# Altium project L_ASMR.PrjPcb
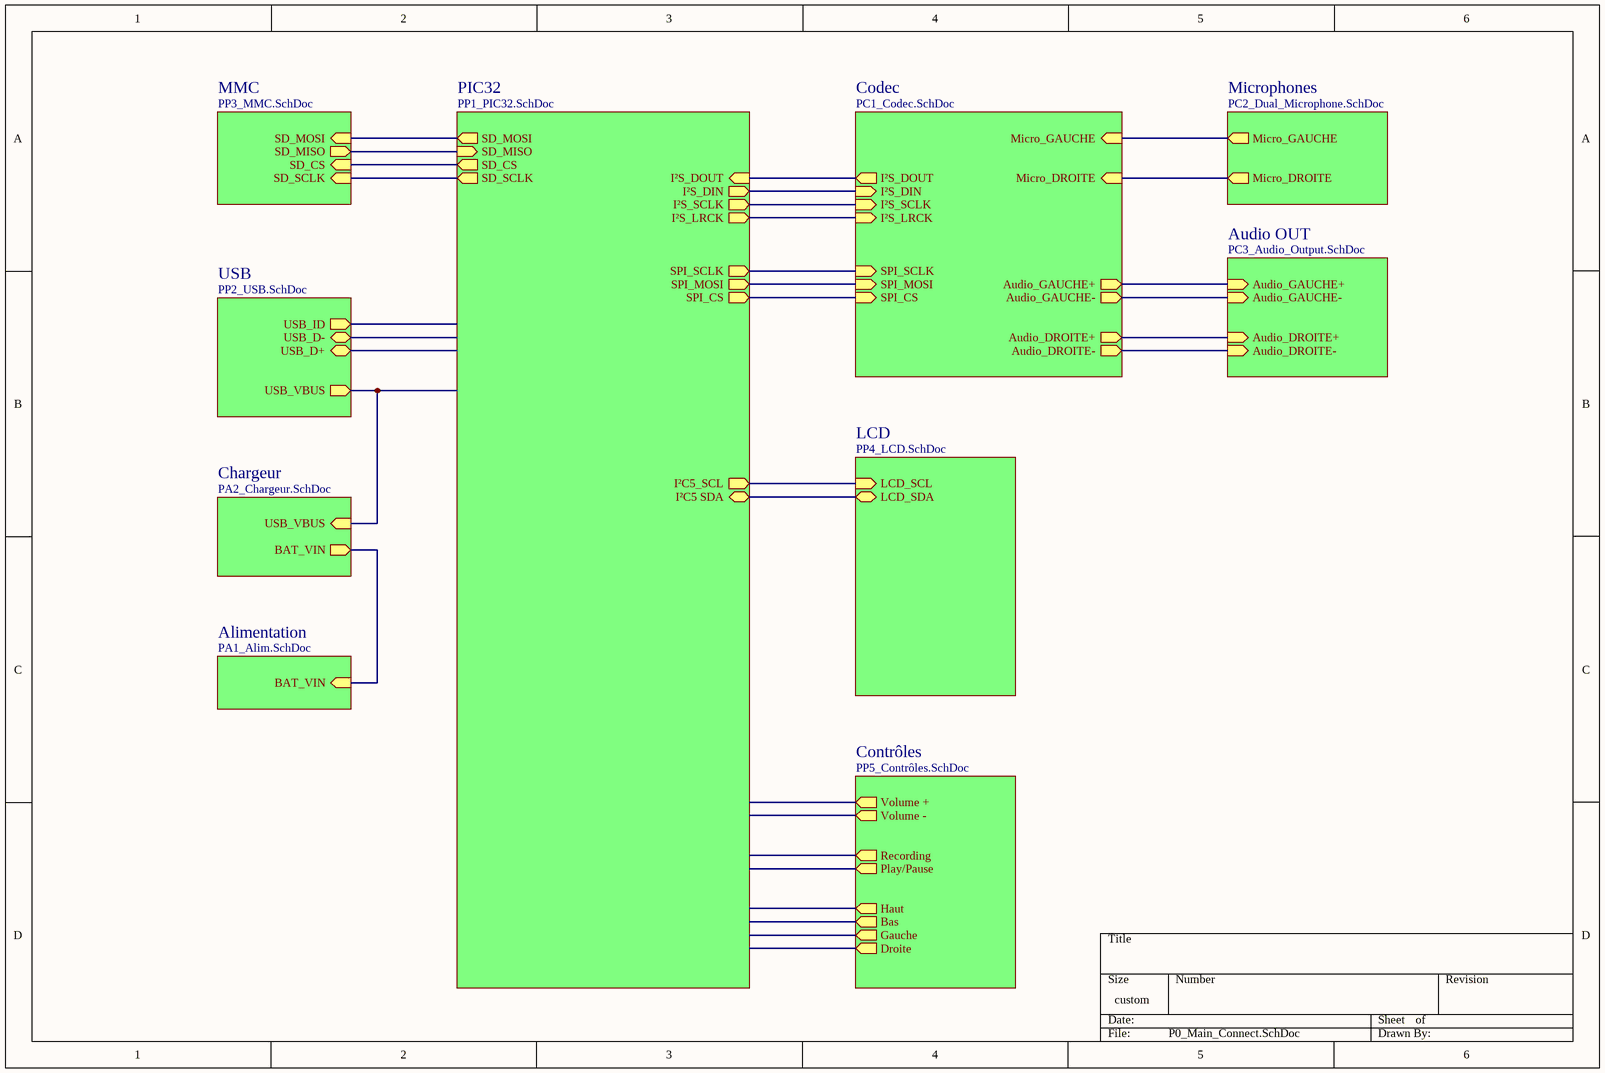
[diagram p0: P0_Main_Connect.SchDoc]
11 sheets, 116 parts. Net scope: hierarchical (ports join the sheet entries above them; power ports are global).
Sheets:
  P0_Main_Connect.SchDoc
    Alimentation = PA1_Alim.SchDoc
    Microphones = PC2_Dual_Microphone.SchDoc
    Audio OUT = PC3_Audio_Output.SchDoc
    Codec = PC1_Codec.SchDoc
    PIC32 = PP1_PIC32.SchDoc
    USB = PP2_USB.SchDoc
    MMC = PP3_MMC.SchDoc
    Chargeur = PA2_Chargeur.SchDoc
    LCD = PP4_LCD.SchDoc
    Contrôles = PP5_Contrôles.SchDoc

## Sheet P0_Main_Connect.SchDoc
size 299 x 199 mm

### Sub-sheets
Alimentation = PA1_Alim.SchDoc: BAT_VIN (in)
Audio OUT = PC3_Audio_Output.SchDoc: Audio_GAUCHE+ (in), Audio_GAUCHE- (in), Audio_DROITE+ (in), Audio_DROITE- (in)
Chargeur = PA2_Chargeur.SchDoc: USB_VBUS (in), BAT_VIN (out)
Codec = PC1_Codec.SchDoc: Micro_GAUCHE (in), Micro_DROITE (in), Audio_GAUCHE+ (out), Audio_GAUCHE- (out), Audio_DROITE+ (out), Audio_DROITE- (out), I²S_DIN (in), I²S_DOUT (out), SPI_MOSI (in), I²S_LRCK (in), I²S_SCLK (in), SPI_SCLK (in), SPI_CS (in)
Contrôles = PP5_Contrôles.SchDoc: Haut (out), Play/Pause (out), Bas (out), Recording (out), Volume + (out), Volume - (out), Gauche (out), Droite (out)
LCD = PP4_LCD.SchDoc: LCD_SCL (in), LCD_SDA (bidir)
Microphones = PC2_Dual_Microphone.SchDoc: Micro_GAUCHE (out), Micro_DROITE (out)
MMC = PP3_MMC.SchDoc: SD_MOSI (in), SD_MISO (out), SD_CS (in), SD_SCLK (in)
PIC32 = PP1_PIC32.SchDoc: I²C5_SCL (out), I²C5 SDA (bidir), I²S_LRCK (out), I²S_DIN (out), I²S_SCLK (out), I²S_DOUT (in), SPI_MOSI (out), SPI_CS (out), SPI_SCLK (out), SD_SCLK (out), SD_CS (out), SD_MOSI (out), SD_MISO (in)
USB = PP2_USB.SchDoc: USB_ID (out), USB_D- (bidir), USB_D+ (bidir), USB_VBUS (out)

### Nets
CS: sheet PIC32/SD_CS, sheet MMC/SD_CS
MISO: sheet PIC32/SD_MISO, sheet MMC/SD_MISO
MOSI: sheet PIC32/SD_MOSI, sheet MMC/SD_MOSI
SCLK: sheet PIC32/SD_SCLK, sheet MMC/SD_SCLK
NetC?#5_2: sheet Microphones/Micro_GAUCHE, sheet Codec/Micro_GAUCHE
NetC?#11_2: sheet Microphones/Micro_DROITE, sheet Codec/Micro_DROITE
NetC?#14_1: sheet Audio OUT/Audio_GAUCHE-, sheet Codec/Audio_GAUCHE-
NetC?#17_1: sheet Audio OUT/Audio_GAUCHE+, sheet Codec/Audio_GAUCHE+
NetC?#20_1: sheet Audio OUT/Audio_DROITE-, sheet Codec/Audio_DROITE-
NetC?#23_1: sheet Audio OUT/Audio_DROITE+, sheet Codec/Audio_DROITE+
NetC?#37_2: sheet USB/USB_VBUS, sheet Chargeur/USB_VBUS
NetC?#40_2: sheet Alimentation/BAT_VIN, sheet Chargeur/BAT_VIN
NetDS?_3: sheet PIC32/I²C5_SCL, sheet LCD/LCD_SCL
NetDS?_4: sheet PIC32/I²C5 SDA, sheet LCD/LCD_SDA
NetU?#8_43: sheet Codec/SPI_MOSI, sheet PIC32/SPI_MOSI
NetU?#8_44: sheet Codec/SPI_SCLK, sheet PIC32/SPI_SCLK
NetU?#8_45: sheet Codec/SPI_CS, sheet PIC32/SPI_CS
(unnamed): sheet Codec/I²S_DIN, sheet PIC32/I²S_DIN
(unnamed): sheet Codec/I²S_DOUT, sheet PIC32/I²S_DOUT
(unnamed): sheet Codec/I²S_LRCK, sheet PIC32/I²S_LRCK
(unnamed): sheet Codec/I²S_SCLK, sheet PIC32/I²S_SCLK

## Sheet PA1_Alim.SchDoc
size 199 x 149 mm
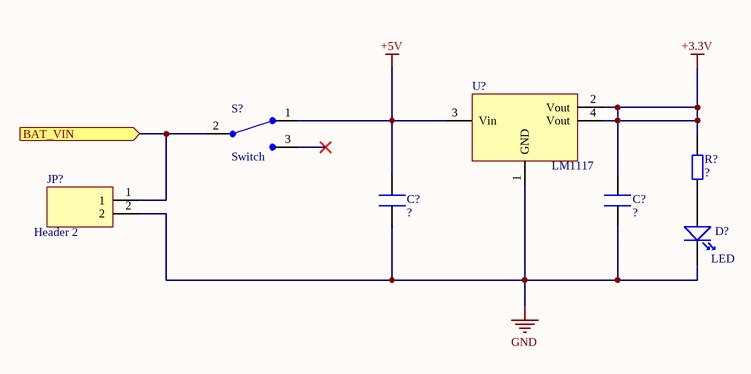
[diagram p1: PA1_Alim.SchDoc]

### Parts
(Parts that share a designator on the sheet are numbered #1, #2 ... from top to bottom, then left to right.)
C?#1  Condo  (value not drawn)  (no BOM)
C?#2  Condo  (value not drawn)  (no BOM)
D?#1  LED  (no BOM)
JP?#1  Header 2  (no BOM)
R?#1  Res  (value not drawn)  (no BOM)
S?#1  Switch  (no BOM)
U?#1  LM1117

### Ports
BAT_VIN (in)

### Nets
+3.3V: C?#2.2 R?#1.2 U?#1.2(Vout) U?#1.4(Vout)
+5V: C?#1.2 S?#1.1(Vout) U?#1.3(Vin)
GND: C?#1.1 C?#2.1 D?#1.2(-) JP?#1.2 U?#1.1(GND)
NetC?#40_2: JP?#1.1 S?#1.2(Vin) ; port BAT_VIN
NetD?#1_1: D?#1.1(+) R?#1.1

Not connected (* = marked no-connect by the designer): S?#1 3(NC)*

### Library data of the parts
C?#1 C?#2 = Condo: Condensateur; Valeur: ?
D?#1 = LED: LED Standard
JP?#1 = Header 2: Header 2 Pins Mâle
R?#1 = Res: Résistance; Valeur: ?
S?#1 = Switch: Switch Standard 3 Pins
U?#1 = LM1117: Régulateur de tension; Fabricant: Texas Instruments; DataSheet: http://www.farnell.com/datasheets/2019100.pdf; RefFabricant: LM1117

## Sheet PC2_Dual_Microphone.SchDoc
size 250 x 200 mm
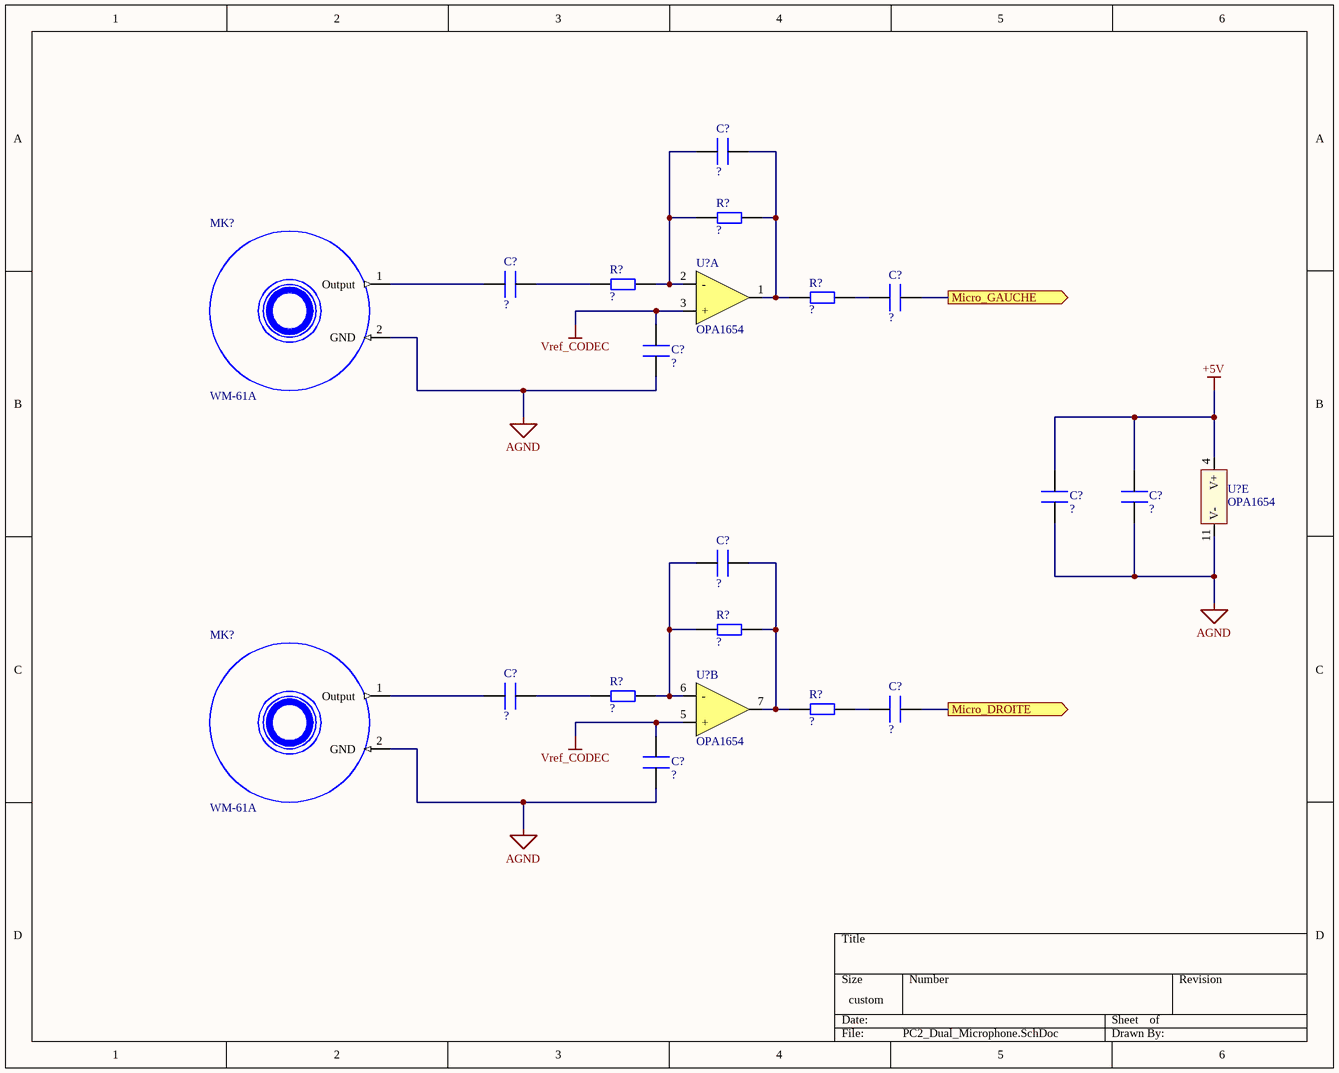
[diagram p2: PC2_Dual_Microphone.SchDoc]

### Parts
(Parts that share a designator on the sheet are numbered #1, #2 ... from top to bottom, then left to right.)
C?#3  Condo  (value not drawn)  (no BOM)
C?#4  Condo  (value not drawn)  (no BOM)
C?#5  Condo  (value not drawn)  (no BOM)
C?#6  Condo  (value not drawn)  (no BOM)
C?#7  Condo  (value not drawn)  (no BOM)
C?#8  Condo  (value not drawn)  (no BOM)
C?#9  Condo  (value not drawn)  (no BOM)
C?#10  Condo  (value not drawn)  (no BOM)
C?#11  Condo  (value not drawn)  (no BOM)
C?#12  Condo  (value not drawn)  (no BOM)
MK?#1  WM-61A
MK?#2  WM-61A
R?#2  Res  (value not drawn)  (no BOM)
R?#3  Res  (value not drawn)  (no BOM)
R?#4  Res  (value not drawn)  (no BOM)
R?#5  Res  (value not drawn)  (no BOM)
R?#6  Res  (value not drawn)  (no BOM)
R?#7  Res  (value not drawn)  (no BOM)
U?#2  OPA1654  (part A of 5)
U?#3  OPA1654  (part E of 5)
U?#4  OPA1654  (part B of 5)

### Ports
Micro_DROITE (out), Micro_GAUCHE (out)

### Nets
+5V: C?#7.2 C?#8.2 U?#3.4(V+)
AGND: C?#6.1 C?#7.1 C?#8.1 C?#12.1 MK?#1.2(GND) MK?#2.2(GND) U?#3.11(V-)
Vref_CODEC: C?#6.2 C?#12.2 U?#2.3(+) U?#4.5(+)
NetC?#3_1: C?#3.1 R?#2.2 R?#4.1 U?#2.1(OUT)
NetC?#3_2: C?#3.2 R?#2.1 R?#3.2 U?#2.2(-)
NetC?#4_1: C?#4.1 MK?#1.1(Output)
NetC?#4_2: C?#4.2 R?#3.1
NetC?#5_1: C?#5.1 R?#4.2
NetC?#5_2: C?#5.2 ; port Micro_GAUCHE
NetC?#9_1: C?#9.1 R?#5.2 R?#7.1 U?#4.7(OUT)
NetC?#9_2: C?#9.2 R?#5.1 R?#6.2 U?#4.6(-)
NetC?#10_1: C?#10.1 MK?#2.1(Output)
NetC?#10_2: C?#10.2 R?#6.1
NetC?#11_1: C?#11.1 R?#7.2
NetC?#11_2: C?#11.2 ; port Micro_DROITE

### Library data of the parts
C?#3-C?#12 = Condo: Condensateur; Valeur: ?
MK?#1 MK?#2 = WM-61A: Microphone (sur Header); Fabricant: INSIKES; RefFabricant: WM-61A; DataSheet: https://components101.com/sites/default/files/component_datasheet/Electret%20Condenser%20Microphone.pdf
R?#2-R?#7 = Res: Résistance; Valeur: ?
U?#2-U?#4 = OPA1654: Quad Audio AmpliOp; Fabricant: TEXAS INSTRUMENTS; RefFabricant: OPA1654; DataSheet: http://www.ti.com/lit/ds/symlink/opa1654.pdf

## Sheet PC3_Audio_Output.SchDoc
size 250 x 200 mm
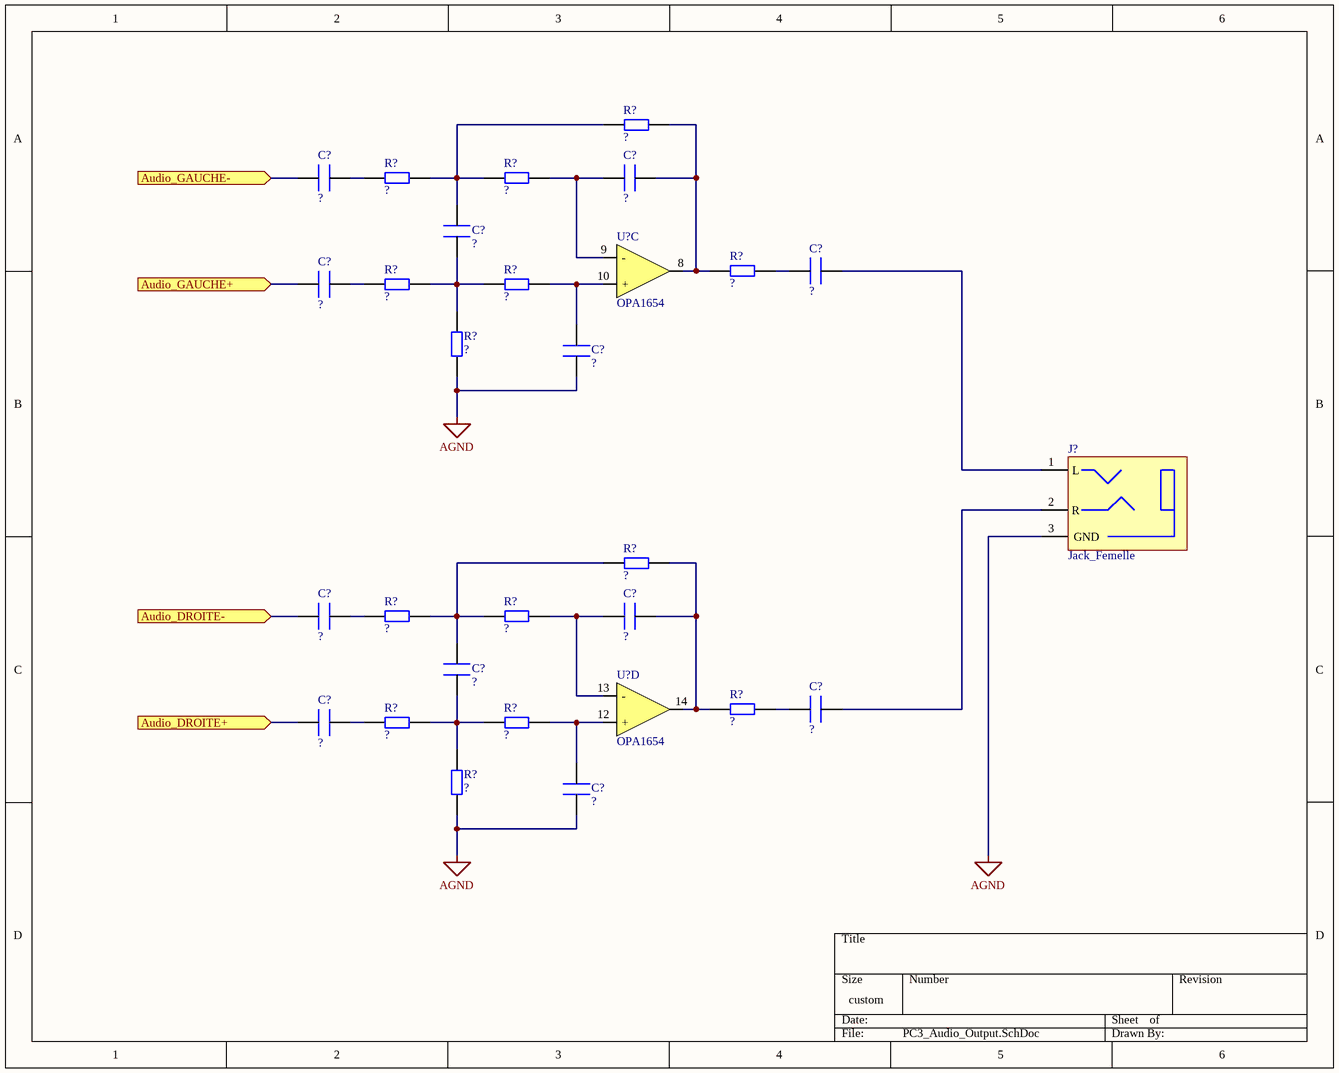
[diagram p3: PC3_Audio_Output.SchDoc]

### Parts
(Parts that share a designator on the sheet are numbered #1, #2 ... from top to bottom, then left to right.)
C?#13  Condo  (value not drawn)  (no BOM)
C?#14  Condo  (value not drawn)  (no BOM)
C?#15  Condo  (value not drawn)  (no BOM)
C?#16  Condo  (value not drawn)  (no BOM)
C?#17  Condo  (value not drawn)  (no BOM)
C?#18  Condo  (value not drawn)  (no BOM)
C?#19  Condo  (value not drawn)  (no BOM)
C?#20  Condo  (value not drawn)  (no BOM)
C?#21  Condo  (value not drawn)  (no BOM)
C?#22  Condo  (value not drawn)  (no BOM)
C?#23  Condo  (value not drawn)  (no BOM)
C?#24  Condo  (value not drawn)  (no BOM)
J?  Jack_Femelle
R?#8  Res  (value not drawn)  (no BOM)
R?#9  Res  (value not drawn)  (no BOM)
R?#10  Res  (value not drawn)  (no BOM)
R?#11  Res  (value not drawn)  (no BOM)
R?#12  Res  (value not drawn)  (no BOM)
R?#13  Res  (value not drawn)  (no BOM)
R?#14  Res  (value not drawn)  (no BOM)
R?#15  Res  (value not drawn)  (no BOM)
R?#16  Res  (value not drawn)  (no BOM)
R?#17  Res  (value not drawn)  (no BOM)
R?#18  Res  (value not drawn)  (no BOM)
R?#19  Res  (value not drawn)  (no BOM)
R?#20  Res  (value not drawn)  (no BOM)
R?#21  Res  (value not drawn)  (no BOM)
U?#5  OPA1654  (part C of 5)
U?#6  OPA1654  (part D of 5)

### Ports
Audio_DROITE+ (in), Audio_DROITE- (in), Audio_GAUCHE+ (in), Audio_GAUCHE- (in)

### Nets
AGND: C?#18.1 C?#24.1 J?.3(GND) R?#14.1 R?#21.1
NetC?#13_1: C?#13.1 R?#8.2 R?#11.2 U?#5.8(OUT)
NetC?#13_2: C?#13.2 R?#10.2 U?#5.9(-)
NetC?#14_1: C?#14.1 ; port Audio_GAUCHE-
NetC?#14_2: C?#14.2 R?#9.1
NetC?#15_1: C?#15.1 R?#12.2 R?#13.1 R?#14.2
NetC?#15_2: C?#15.2 R?#8.1 R?#9.2 R?#10.1
NetC?#16_1: C?#16.1 J?.1(L)
NetC?#16_2: C?#16.2 R?#11.1
NetC?#17_1: C?#17.1 ; port Audio_GAUCHE+
NetC?#17_2: C?#17.2 R?#12.1
NetC?#18_2: C?#18.2 R?#13.2 U?#5.10(+)
NetC?#19_1: C?#19.1 R?#15.2 R?#18.2 U?#6.14(OUT)
NetC?#19_2: C?#19.2 R?#17.2 U?#6.13(-)
NetC?#20_1: C?#20.1 ; port Audio_DROITE-
NetC?#20_2: C?#20.2 R?#16.1
NetC?#21_1: C?#21.1 R?#19.2 R?#20.1 R?#21.2
NetC?#21_2: C?#21.2 R?#15.1 R?#16.2 R?#17.1
NetC?#22_1: C?#22.1 J?.2(R)
NetC?#22_2: C?#22.2 R?#18.1
NetC?#23_1: C?#23.1 ; port Audio_DROITE+
NetC?#23_2: C?#23.2 R?#19.1
NetC?#24_2: C?#24.2 R?#20.2 U?#6.12(+)

### Library data of the parts
C?#13-C?#24 = Condo: Condensateur; Valeur: ?
J? = Jack_Femelle: Prise Mini Jack Stéréo Femelle
R?#8-R?#21 = Res: Résistance; Valeur: ?
U?#5 U?#6 = OPA1654: as U?#2 on sheet PC2_Dual_Microphone; RefFabricant: OPA1654; DataSheet: http://www.ti.com/lit/ds/symlink/opa1654.pdf

## Sheet PC1_Codec.SchDoc
size 199 x 149 mm
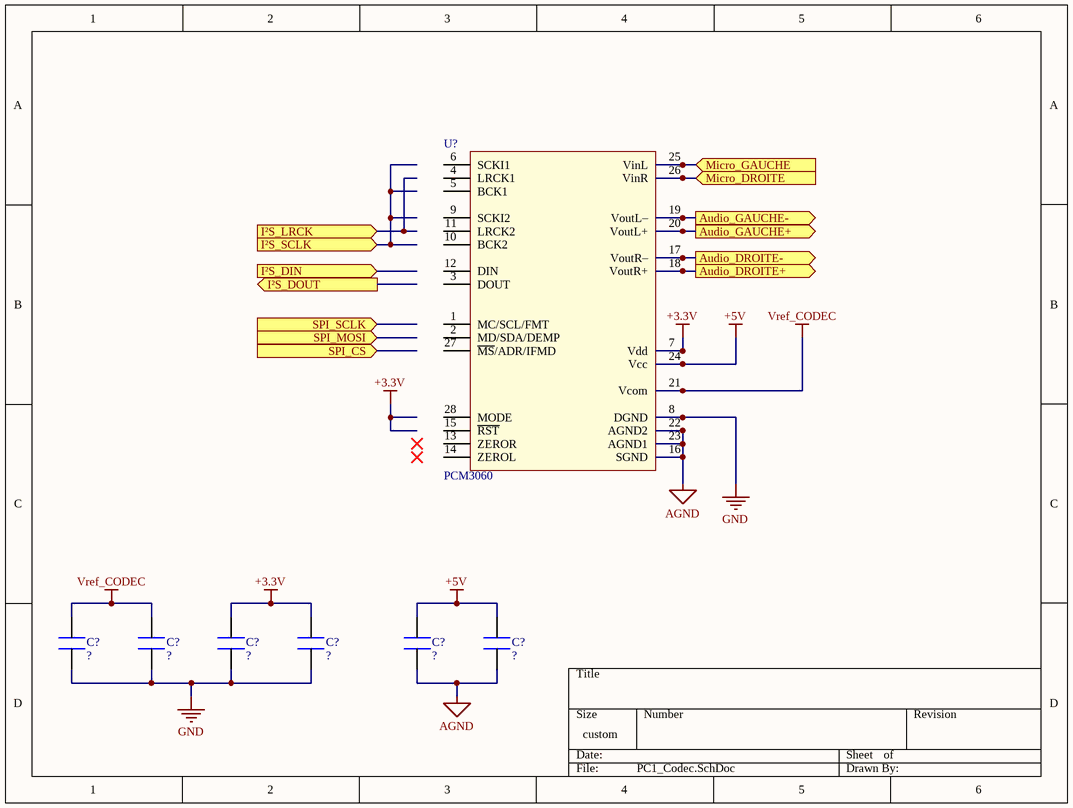
[diagram p4: PC1_Codec.SchDoc]

### Parts
(Parts that share a designator on the sheet are numbered #1, #2 ... from top to bottom, then left to right.)
C?#25  Condo  (value not drawn)  (no BOM)
C?#26  Condo  (value not drawn)  (no BOM)
C?#27  Condo  (value not drawn)  (no BOM)
C?#28  Condo  (value not drawn)  (no BOM)
C?#29  Condo  (value not drawn)  (no BOM)
C?#30  Condo  (value not drawn)  (no BOM)
U?#7  PCM3060

### Ports
Audio_DROITE+ (out), Audio_DROITE- (out), Audio_GAUCHE+ (out), Audio_GAUCHE- (out), I²S_DIN (in), I²S_DOUT (out), I²S_LRCK (in), I²S_SCLK (in), Micro_DROITE (in), Micro_GAUCHE (in), SPI_CS (in), SPI_MOSI (in), SPI_SCLK (in)

### Nets
+3.3V: C?#27.2 C?#28.2 U?#7.7(Vdd)
+5V: C?#29.2 C?#30.2 U?#7.24(Vcc)
AGND: C?#29.1 C?#30.1 U?#7.16(SGND) U?#7.22(AGND2) U?#7.23(AGND1)
GND: C?#25.1 C?#26.1 C?#27.1 C?#28.1 U?#7.8(DGND)
Vref_CODEC: C?#25.2 C?#26.2 U?#7.21(Vcom)
NetC?#5_2: U?#7.25(VinL) ; port Micro_GAUCHE
NetC?#11_2: U?#7.26(VinR) ; port Micro_DROITE
NetC?#14_1: U?#7.19(VoutL–) ; port Audio_GAUCHE-
NetC?#17_1: U?#7.20(VoutL+) ; port Audio_GAUCHE+
NetC?#20_1: U?#7.17(VoutR–) ; port Audio_DROITE-
NetC?#23_1: U?#7.18(VoutR+) ; port Audio_DROITE+

Not connected (* = marked no-connect by the designer): U?#7 1(MC/SCL/FMT) 2(MD/SDA/DEMP) 3(DOUT) 4(LRCK1) 5(BCK1) 6(SCKI1) 9(SCKI2) 10(BCK2) 11(LRCK2) 12(DIN) 13(ZEROR) 14(ZEROL) 15(~{RST}) 27(~{MS}/ADR/IFMD) 28(MODE)

### Library data of the parts
C?#25-C?#30 = Condo: Condensateur; Valeur: ?
U?#7 = PCM3060: Stéréo In/Out Audio Codec; Fabricant: TEXAS INSTRUMENTS; RefFabricant: PCM3060PW; Datasheet: http://www.ti.com/lit/ds/symlink/pcm3060.pdf

## Sheet PP1_PIC32.SchDoc
size 250 x 199 mm
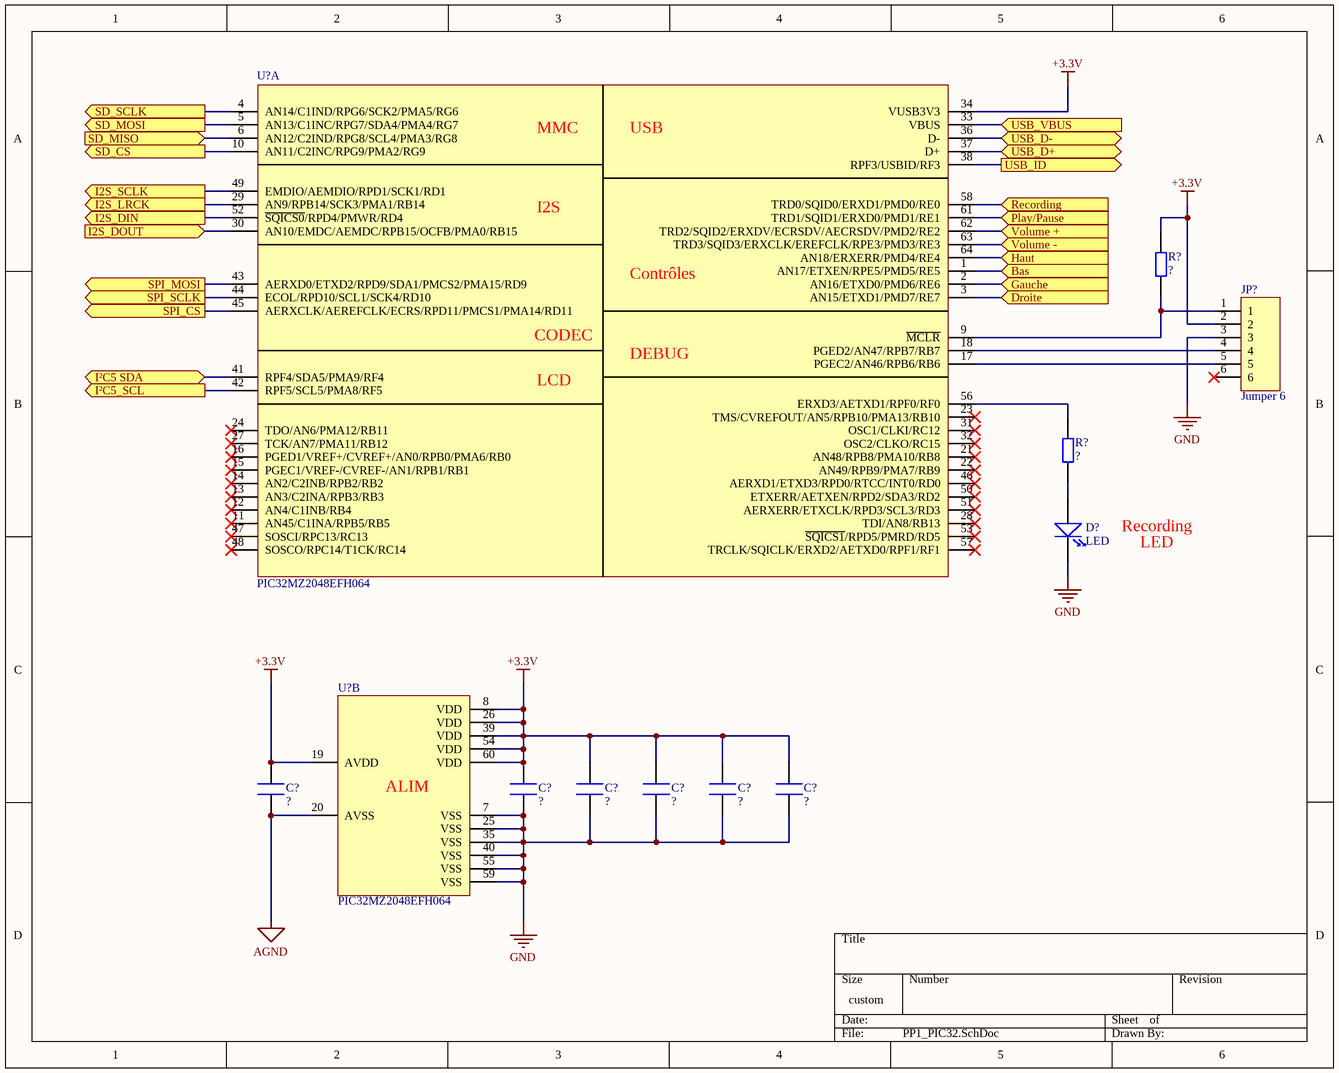
[diagram p5: PP1_PIC32.SchDoc]

### Parts
(Parts that share a designator on the sheet are numbered #1, #2 ... from top to bottom, then left to right.)
C?#31  Condo  (value not drawn)  (no BOM)
C?#32  Condo  (value not drawn)  (no BOM)
C?#33  Condo  (value not drawn)  (no BOM)
C?#34  Condo  (value not drawn)  (no BOM)
C?#35  Condo  (value not drawn)  (no BOM)
C?#36  Condo  (value not drawn)  (no BOM)
D?#2  LED  (no BOM)
JP?#2  Jumper 6  (no BOM)
R?#22  Res  (value not drawn)  (no BOM)
R?#23  Res  (value not drawn)  (no BOM)
U?#8  PIC32MZ2048EFH064  (part A of 2)
U?#9  PIC32MZ2048EFH064  (part B of 2)

### Ports
Bas (in), Droite (in), Gauche (in), Haut (in), I2S_DIN (out), I2S_DOUT (in), I2S_LRCK (out), I2S_SCLK (out), I²C5 SDA (bidir), I²C5_SCL (out), Play/Pause (in), Recording (in), SD_CS (out), SD_MISO (in), SD_MOSI (out), SD_SCLK (out), SPI_CS (out), SPI_MOSI (out), SPI_SCLK (out), USB_D+ (bidir), USB_D- (bidir), USB_ID (out), USB_VBUS (in), Volume + (in), Volume - (in)

### Nets
+3.3V: C?#31.2 C?#32.2 C?#33.2 C?#34.2 C?#35.2 C?#36.2 JP?#2.2 R?#22.1 U?#8.34(VUSB3V3) U?#9.8(VDD) U?#9.19(AVDD) U?#9.26(VDD) U?#9.39(VDD) U?#9.54(VDD) U?#9.60(VDD)
AGND: C?#31.1 U?#9.20(AVSS)
GND: C?#32.1 C?#33.1 C?#34.1 C?#35.1 C?#36.1 D?#2.2(-) JP?#2.3 U?#9.7(VSS) U?#9.25(VSS) U?#9.35(VSS) U?#9.40(VSS) U?#9.55(VSS) U?#9.59(VSS)
CS: U?#8.10(AN11/C2INC/RPG9/PMA2/RG9) ; port SD_CS
MISO: U?#8.6(AN12/C2IND/RPG8/SCL4/PMA3/RG8) ; port SD_MISO
MOSI: U?#8.5(AN13/C1INC/RPG7/SDA4/PMA4/RG7) ; port SD_MOSI
SCLK: U?#8.4(AN14/C1IND/RPG6/SCK2/PMA5/RG6) ; port SD_SCLK
NetD?#2_1: D?#2.1(+) R?#23.1
NetDS?_3: U?#8.42(RPF5/SCL5/PMA8/RF5) ; port I²C5_SCL
NetDS?_4: U?#8.41(RPF4/SDA5/PMA9/RF4) ; port I²C5 SDA
NetJP?#2_1: JP?#2.1 R?#22.2 U?#8.9(~{MCLR})
NetJP?#2_4: JP?#2.4 U?#8.18(PGED2/AN47/RPB7/RB7)
NetJP?#2_5: JP?#2.5 U?#8.17(PGEC2/AN46/RPB6/RB6)
NetR?#23_2: R?#23.2 U?#8.56(ERXD3/AETXD1/RPF0/RF0)
NetU?#8_1: U?#8.1(AN17/ETXEN/RPE5/PMD5/RE5) ; port Bas
NetU?#8_2: U?#8.2(AN16/ETXD0/PMD6/RE6) ; port Gauche
NetU?#8_3: U?#8.3(AN15/ETXD1/PMD7/RE7) ; port Droite
NetU?#8_29: U?#8.29(AN9/RPB14/SCK3/PMA1/RB14) ; port I2S_LRCK
NetU?#8_30: U?#8.30(AN10/EMDC/AEMDC/RPB15/OCFB/PMA0/RB15) ; port I2S_DOUT
NetU?#8_33: U?#8.33(VBUS) ; port USB_VBUS
NetU?#8_36: U?#8.36(D-) ; port USB_D-
NetU?#8_37: U?#8.37(D+) ; port USB_D+
NetU?#8_38: U?#8.38(RPF3/USBID/RF3) ; port USB_ID
NetU?#8_43: U?#8.43(AERXD0/ETXD2/RPD9/SDA1/PMCS2/PMA15/RD9) ; port SPI_MOSI
NetU?#8_44: U?#8.44(ECOL/RPD10/SCL1/SCK4/RD10) ; port SPI_SCLK
NetU?#8_45: U?#8.45(AERXCLK/AEREFCLK/ECRS/RPD11/PMCS1/PMA14/RD11) ; port SPI_CS
NetU?#8_49: U?#8.49(EMDIO/AEMDIO/RPD1/SCK1/RD1) ; port I2S_SCLK
NetU?#8_52: U?#8.52(~{SQICS0}/RPD4/PMWR/RD4) ; port I2S_DIN
NetU?#8_58: U?#8.58(TRD0/SQID0/ERXD1/PMD0/RE0) ; port Recording
NetU?#8_61: U?#8.61(TRD1/SQID1/ERXD0/PMD1/RE1) ; port Play/Pause
NetU?#8_62: U?#8.62(TRD2/SQID2/ERXDV/ECRSDV/AECRSDV/PMD2/RE2) ; port Volume +
NetU?#8_63: U?#8.63(TRD3/SQID3/ERXCLK/EREFCLK/RPE3/PMD3/RE3) ; port Volume -
NetU?#8_64: U?#8.64(AN18/ERXERR/PMD4/RE4) ; port Haut

Not connected (* = marked no-connect by the designer): JP?#2 6*; U?#8 11(AN45/C1INA/RPB5/RB5)* 12(AN4/C1INB/RB4)* 13(AN3/C2INA/RPB3/RB3)* 14(AN2/C2INB/RPB2/RB2)* 15(PGEC1/VREF-/CVREF-/AN1/RPB1/RB1)* 16(PGED1/VREF+/CVREF+/AN0/RPB0/PMA6/RB0)* 21(AN48/RPB8/PMA10/RB8)* 22(AN49/RPB9/PMA7/RB9)* 23(TMS/CVREFOUT/AN5/RPB10/PMA13/RB10)* 24(TDO/AN6/PMA12/RB11)* 27(TCK/AN7/PMA11/RB12)* 28(TDI/AN8/RB13)* 31(OSC1/CLKI/RC12)* 32(OSC2/CLKO/RC15)* 46(AERXD1/ETXD3/RPD0/RTCC/INT0/RD0)* 47(SOSCI/RPC13/RC13)* 48(SOSCO/RPC14/T1CK/RC14)* 50(ETXERR/AETXEN/RPD2/SDA3/RD2)* 51(AERXERR/ETXCLK/RPD3/SCL3/RD3)* 53(~{SQICS1}/RPD5/PMRD/RD5)* 57(TRCLK/SQICLK/ERXD2/AETXD0/RPF1/RF1)*

### Notes on the sheet
- Recording
- LED
- (in symbol PIC32MZ, part A) MMC; USB; I2S; Contrôles; CODEC; DEBUG; LCD
- (in symbol PIC32MZ, part B) ALIM

### Library data of the parts
C?#31-C?#36 = Condo: Condensateur; Valeur: ?
D?#2 = LED: LED Standard
JP?#2 = Jumper 6: Jumper 6 Pins Mâle-Femelle
R?#22 R?#23 = Res: Résistance; Valeur: ?
U?#8 U?#9 = PIC32MZ: Micro-contrôleur PIC32MZ; Fabricant: Microchip; RefFabricant: PIC32MZ2048EFH064; DataSheet: http://ww1.microchip.com/downloads/en/DeviceDoc/60001320D.pdf

## Sheet PP2_USB.SchDoc
size 199 x 119 mm
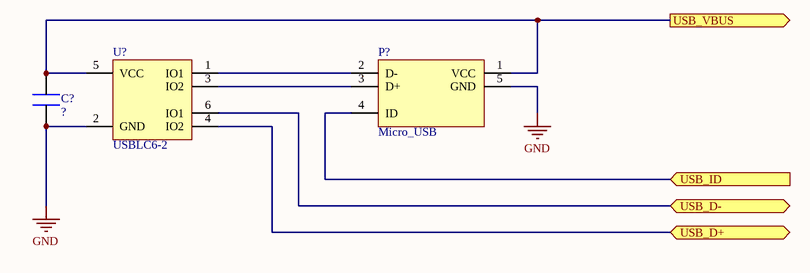
[diagram p6: PP2_USB.SchDoc]

### Parts
(Parts that share a designator on the sheet are numbered #1, #2 ... from top to bottom, then left to right.)
C?#37  Condo  (value not drawn)  (no BOM)
P?#1  Micro_USB
U?#10  USBLC6-2

### Ports
USB_D+ (bidir), USB_D- (bidir), USB_ID (in), USB_VBUS (out)

### Nets
GND: C?#37.1 P?#1.5(GND) U?#10.2(GND)
NetC?#37_2: C?#37.2 P?#1.1(VCC) U?#10.5(VCC) ; port USB_VBUS
NetP?#1_2: P?#1.2(D-) U?#10.1(IO1)
NetP?#1_3: P?#1.3(D+) U?#10.3(IO2)
NetP?#1_4: P?#1.4(ID) ; port USB_ID
NetU?#10_4: U?#10.4(IO2) ; port USB_D+
NetU?#10_6: U?#10.6(IO1) ; port USB_D-

### Library data of the parts
C?#37 = Condo: Condensateur; Valeur: ?
P?#1 = Micro_USB: Prise Micro USB Femelle
U?#10 = USBLC6-2: Protection_ESD; DataSheet: http://www.st.com/content/ccc/resource/technical/document/datasheet/06/1d/48/9c/6c/20/4a/b2/CD00050750.pdf/files/CD00050750.pdf/jcr:content/translations/en.CD00050750.pdf

## Sheet PP3_MMC.SchDoc
size 149 x 100 mm
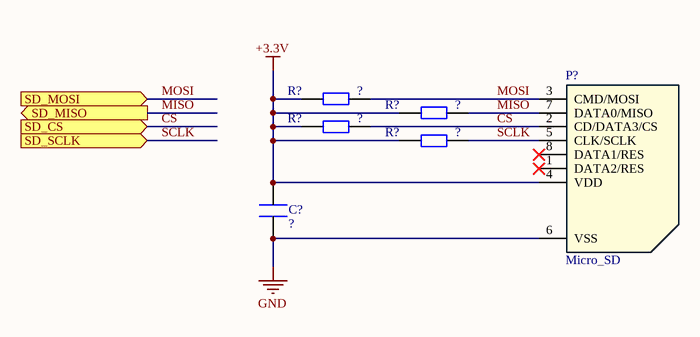
[diagram p7: PP3_MMC.SchDoc]

### Parts
(Parts that share a designator on the sheet are numbered #1, #2 ... from top to bottom, then left to right.)
C?#38  Condo  (value not drawn)  (no BOM)
P?#2  Micro_SD
R?#24  Res  (value not drawn)  (no BOM)
R?#25  Res  (value not drawn)  (no BOM)
R?#26  Res  (value not drawn)  (no BOM)
R?#27  Res  (value not drawn)  (no BOM)

### Ports
SD_CS (in), SD_MISO (out), SD_MOSI (in), SD_SCLK (in)

### Nets
+3.3V: C?#38.2 P?#2.4(VDD) R?#24.1 R?#25.1 R?#26.1 R?#27.1
GND: C?#38.1 P?#2.6(VSS)
CS: P?#2.2(CD/DATA3/CS) R?#26.2 ; port SD_CS
MISO: P?#2.7(DATA0/MISO) R?#25.2 ; port SD_MISO
MOSI: P?#2.3(CMD/MOSI) R?#24.2 ; port SD_MOSI
SCLK: P?#2.5(CLK/SCLK) R?#27.2 ; port SD_SCLK

Not connected (* = marked no-connect by the designer): P?#2 1(DATA2/RES)* 8(DATA1/RES)*

### Library data of the parts
C?#38 = Condo: Condensateur; Valeur: ?
P?#2 = Micro_SD: Embase de Carte SD
R?#24-R?#27 = Res: Résistance; Valeur: ?

## Sheet PA2_Chargeur.SchDoc
size 199 x 119 mm
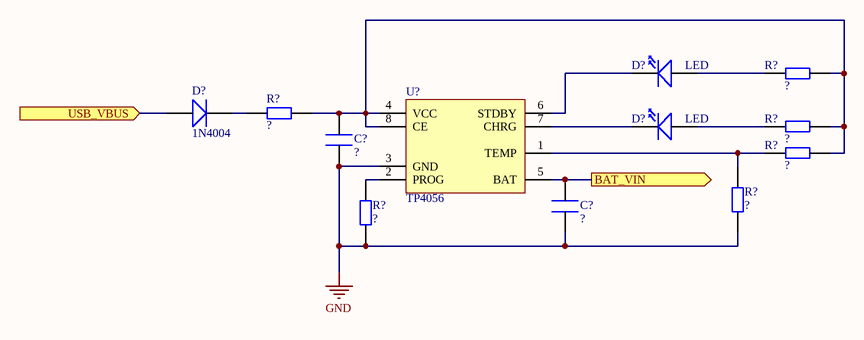
[diagram p8: PA2_Chargeur.SchDoc]

### Parts
(Parts that share a designator on the sheet are numbered #1, #2 ... from top to bottom, then left to right.)
C?#39  Condo  (value not drawn)  (no BOM)
C?#40  Condo  (value not drawn)  (no BOM)
D?#3  LED  (no BOM)
D?#4  1N4004  (no BOM)
D?#5  LED  (no BOM)
R?#28  Res  (value not drawn)  (no BOM)
R?#29  Res  (value not drawn)  (no BOM)
R?#30  Res  (value not drawn)  (no BOM)
R?#31  Res  (value not drawn)  (no BOM)
R?#32  Res  (value not drawn)  (no BOM)
R?#33  Res  (value not drawn)  (no BOM)
U?#11  TP4056

### Ports
BAT_VIN (out), USB_VBUS (in)

### Nets
GND: C?#39.1 C?#40.1 R?#31.2 R?#33.2 U?#11.3(GND)
NetC?#37_2: D?#4.1(+) ; port USB_VBUS
NetC?#39_2: C?#39.2 R?#28.2 R?#29.2 R?#30.2 R?#32.2 U?#11.4(VCC) U?#11.8(CE)
NetC?#40_2: C?#40.2 U?#11.5(BAT) ; port BAT_VIN
NetD?#3_1: D?#3.1(+) R?#28.1
NetD?#3_2: D?#3.2(-) U?#11.6(STDBY)
NetD?#4_2: D?#4.2(-) R?#29.1
NetD?#5_1: D?#5.1(+) R?#30.1
NetD?#5_2: D?#5.2(-) U?#11.7(CHRG)
NetR?#31_1: R?#31.1 R?#32.1 U?#11.1(TEMP)
NetR?#33_1: R?#33.1 U?#11.2(PROG)

### Library data of the parts
C?#39 C?#40 = Condo: Condensateur; Valeur: ?
D?#3 D?#5 = LED: LED Standard
D?#4 = 1N4004: Diode Standard
R?#28-R?#33 = Res: Résistance; Valeur: ?
U?#11 = TP4056: Adaptateur de charge USB vers Batterie; DataSheet: https://dlnmh9ip6v2uc.cloudfront.net/datasheets/Prototyping/TP4056.pdf

## Sheet PP4_LCD.SchDoc
size 149 x 100 mm
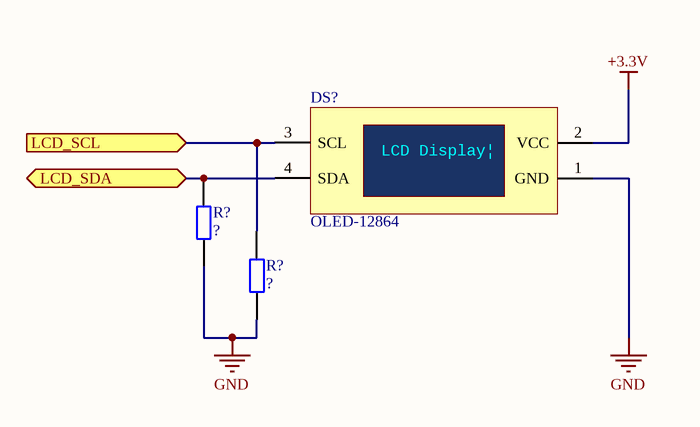
[diagram p9: PP4_LCD.SchDoc]

### Parts
(Parts that share a designator on the sheet are numbered #1, #2 ... from top to bottom, then left to right.)
DS?  OLED-12864
R?#34  Res  (value not drawn)  (no BOM)
R?#35  Res  (value not drawn)  (no BOM)

### Ports
LCD_SCL (in), LCD_SDA (bidir)

### Nets
+3.3V: DS?.2(VCC)
GND: DS?.1(GND) R?#34.1 R?#35.1
NetDS?_3: DS?.3(SCL) R?#35.2 ; port LCD_SCL
NetDS?_4: DS?.4(SDA) R?#34.2 ; port LCD_SDA

### Notes on the sheet
- (in symbol OLED-12864) LCD Display|

### Library data of the parts
DS? = OLED-12864: Ecran LCD 0.96" 128x64pix; Fabricant: Vishay; RefFabricant: OLED-12864; DataSheet: https://www.vishay.com/docs/37902/oled128o064dbpp3n00000.pdf; Tutorial: https://cdn-learn.adafruit.com/downloads/pdf/monochrome-oled-breakouts.pdf
R?#34 R?#35 = Res: Résistance; Valeur: ?

## Sheet PP5_Contrôles.SchDoc
size 199 x 200 mm
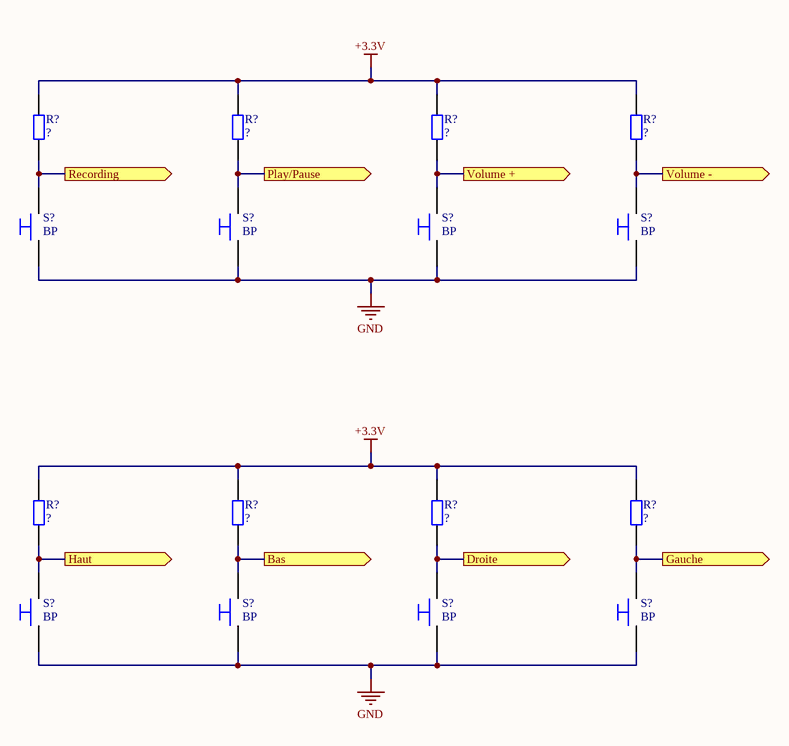
[diagram p10: PP5_Contrôles.SchDoc]

### Parts
(Parts that share a designator on the sheet are numbered #1, #2 ... from top to bottom, then left to right.)
R?#36  Res  (value not drawn)  (no BOM)
R?#37  Res  (value not drawn)  (no BOM)
R?#38  Res  (value not drawn)  (no BOM)
R?#39  Res  (value not drawn)  (no BOM)
R?#40  Res  (value not drawn)  (no BOM)
R?#41  Res  (value not drawn)  (no BOM)
R?#42  Res  (value not drawn)  (no BOM)
R?#43  Res  (value not drawn)  (no BOM)
S?#2  BP  (no BOM)
S?#3  BP  (no BOM)
S?#4  BP  (no BOM)
S?#5  BP  (no BOM)
S?#6  BP  (no BOM)
S?#7  BP  (no BOM)
S?#8  BP  (no BOM)
S?#9  BP  (no BOM)

### Ports
Bas (out), Droite (out), Gauche (out), Haut (out), Play/Pause (out), Recording (out), Volume + (out), Volume - (out)

### Nets
+3.3V: R?#36.2 R?#37.2 R?#38.2 R?#39.2 R?#40.2 R?#41.2 R?#42.2 R?#43.2
GND: S?#2.1 S?#3.1 S?#4.1 S?#5.1 S?#6.1 S?#7.1 S?#8.1 S?#9.1
NetR?#36_1: R?#36.1 S?#2.2 ; port Recording
NetR?#37_1: R?#37.1 S?#3.2 ; port Play/Pause
NetR?#38_1: R?#38.1 S?#4.2 ; port Volume +
NetR?#39_1: R?#39.1 S?#5.2 ; port Volume -
NetR?#40_1: R?#40.1 S?#6.2 ; port Haut
NetR?#41_1: R?#41.1 S?#7.2 ; port Bas
NetR?#42_1: R?#42.1 S?#8.2 ; port Droite
NetR?#43_1: R?#43.1 S?#9.2 ; port Gauche

### Library data of the parts
R?#36-R?#43 = Res: Résistance; Valeur: ?
S?#2-S?#9 = BP: Bouton Poussoir

## Nets that join several sheets
+3.3V: PA1_Alim (C?#2.2 R?#1.2 U?#1.2 U?#1.4), PC1_Codec (C?#27.2 C?#28.2 U?#7.7), PP1_PIC32 (15 pins), PP3_MMC (6 pins), PP4_LCD (DS?.2), PP5_Contrôles (8 pins)
+5V: PA1_Alim (C?#1.2 S?#1.1 U?#1.3), PC2_Dual_Microphone (C?#7.2 C?#8.2 U?#3.4), PC1_Codec (C?#29.2 C?#30.2 U?#7.24)
AGND: PC2_Dual_Microphone (7 pins), PC3_Audio_Output (5 pins), PC1_Codec (5 pins), PP1_PIC32 (C?#31.1 U?#9.20)
GND: PA1_Alim (5 pins), PC1_Codec (5 pins), PP1_PIC32 (13 pins), PP2_USB (C?#37.1 P?#1.5 U?#10.2), PP3_MMC (C?#38.1 P?#2.6), PA2_Chargeur (5 pins), PP4_LCD (DS?.1 R?#34.1 R?#35.1), PP5_Contrôles (8 pins)
Vref_CODEC: PC2_Dual_Microphone (C?#6.2 C?#12.2 U?#2.3 U?#4.5), PC1_Codec (C?#25.2 C?#26.2 U?#7.21)
CS: PP1_PIC32 (U?#8.10), PP3_MMC (P?#2.2 R?#26.2)
MISO: PP1_PIC32 (U?#8.6), PP3_MMC (P?#2.7 R?#25.2)
MOSI: PP1_PIC32 (U?#8.5), PP3_MMC (P?#2.3 R?#24.2)
NetC?#5_2: PC2_Dual_Microphone (C?#5.2), PC1_Codec (U?#7.25)
NetC?#11_2: PC2_Dual_Microphone (C?#11.2), PC1_Codec (U?#7.26)
NetC?#14_1: PC3_Audio_Output (C?#14.1), PC1_Codec (U?#7.19)
NetC?#17_1: PC3_Audio_Output (C?#17.1), PC1_Codec (U?#7.20)
NetC?#20_1: PC3_Audio_Output (C?#20.1), PC1_Codec (U?#7.17)
NetC?#23_1: PC3_Audio_Output (C?#23.1), PC1_Codec (U?#7.18)
NetC?#37_2: PP2_USB (C?#37.2 P?#1.1 U?#10.5), PA2_Chargeur (D?#4.1)
NetC?#40_2: PA1_Alim (JP?#1.1 S?#1.2), PA2_Chargeur (C?#40.2 U?#11.5)
NetDS?_3: PP1_PIC32 (U?#8.42), PP4_LCD (DS?.3 R?#35.2)
NetDS?_4: PP1_PIC32 (U?#8.41), PP4_LCD (DS?.4 R?#34.2)
SCLK: PP1_PIC32 (U?#8.4), PP3_MMC (P?#2.5 R?#27.2)